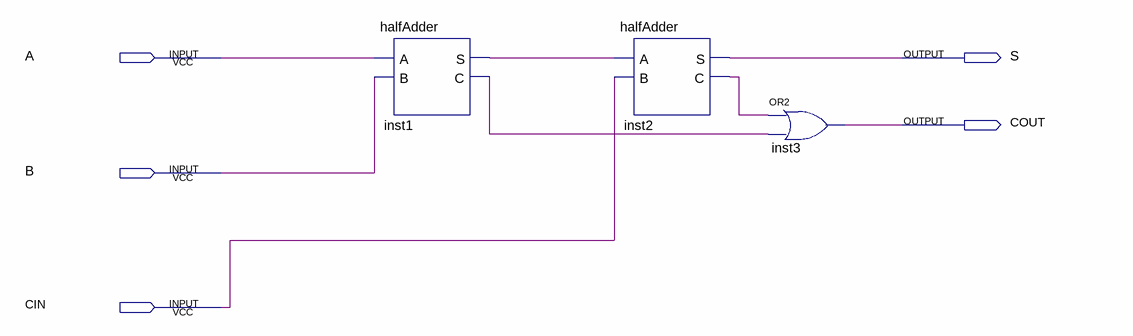
[diagram p0: schematic sheet]
// Quartus schematic fullAdder.bdf as structural Verilog: 3 symbols, 5 pins
module fullAdder (
  input  A,
  input  B,
  input  CIN,
  output S,
  output COUT
);

  wire inst1_c, inst1_s, inst2_c;

  halfAdder inst1 (.A(A), .B(B), .S(inst1_s), .C(inst1_c));
  halfAdder inst2 (.A(inst1_s), .B(CIN), .S(S), .C(inst2_c));
  or inst3 (COUT, inst2_c, inst1_c);
endmodule
